# Altium schematic sheet Davinci Resolve Editor Keyboard.SchDoc: STM32F103 Mini Editor Keyboard
size A3; DrawnBy: Roman Sklyar; Organization: S-LAB; Address1: Russian Federation; Address2: Sergiev Posad; DocumentNumber: 1; Revision: v1.0; SheetNumber: 1; SheetTotal: 6
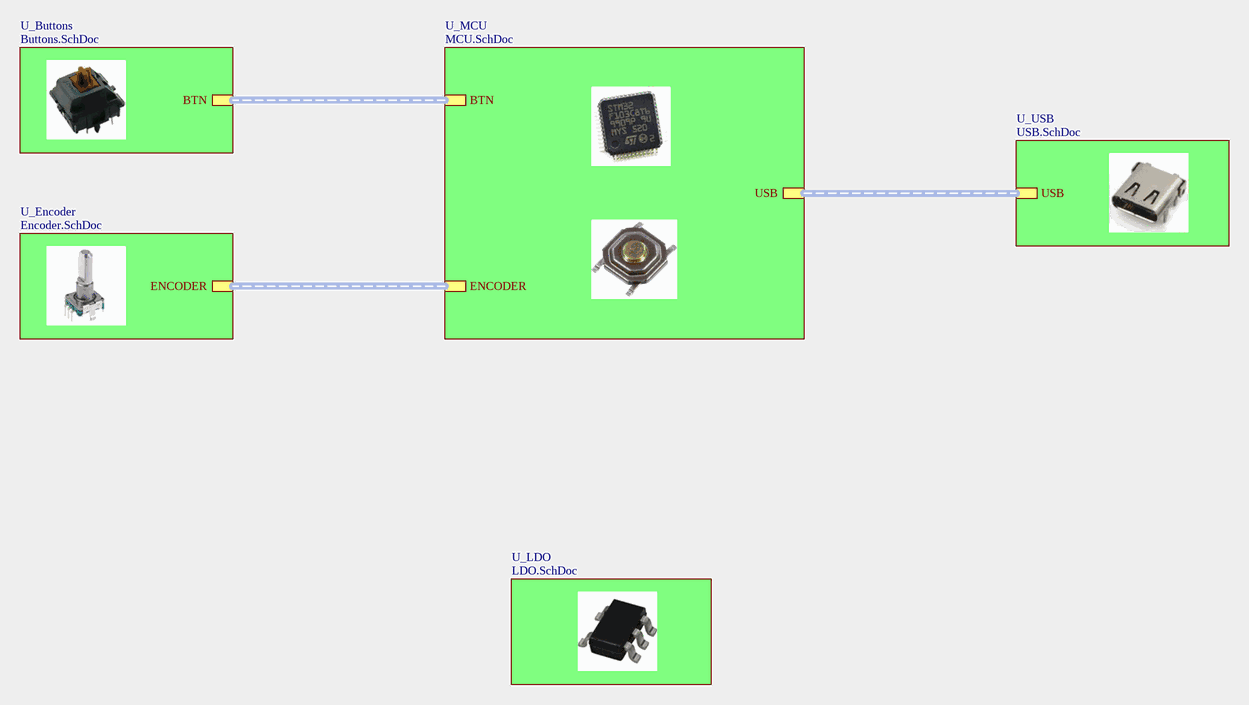
[diagram p0: Davinci Resolve Editor Keyboard.SchDoc]

## Sub-sheets
U_Buttons = Buttons.SchDoc: BTN (harness BTN)
U_Encoder = Encoder.SchDoc: ENCODER (harness ENCODER)
U_LDO = LDO.SchDoc: no entries
U_MCU = MCU.SchDoc: BTN (harness BTN), ENCODER (harness ENCODER), USB (harness USB)
U_USB = USB.SchDoc: USB (harness USB)

## Buses and harness runs
harness sheet U_Buttons/BTN = sheet U_MCU/BTN
harness sheet U_Encoder/ENCODER = sheet U_MCU/ENCODER
harness sheet U_MCU/USB = sheet U_USB/USB

## Notes on the sheet
- Title
- Size:
- Date:
- A3
- Number:
- Time:
- Revision:
- Sheet
- of
- File: